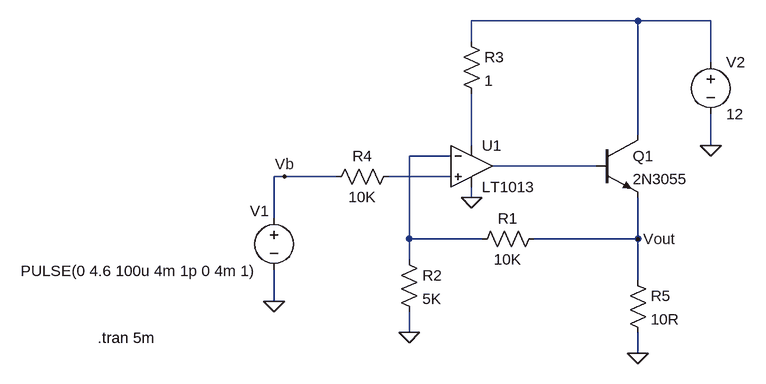
[diagram p0: schematic LM358 Opamp Voltage Source.asc]
LM358 Opamp Voltage Source.asc, the LTspice schematic file:
Version 4
SHEET 1 1400 680
WIRE 816 -128 560 -128
WIRE 928 -128 816 -128
WIRE 560 -96 560 -128
WIRE 928 -64 928 -128
WIRE 816 48 816 -128
WIRE 560 64 560 -16
WIRE 928 64 928 16
WIRE 528 80 464 80
WIRE 752 96 592 96
WIRE 272 112 256 112
WIRE 352 112 272 112
WIRE 528 112 432 112
WIRE 560 144 560 128
WIRE 256 176 256 112
WIRE 464 208 464 80
WIRE 576 208 464 208
WIRE 816 208 816 144
WIRE 816 208 656 208
WIRE 464 240 464 208
WIRE 816 272 816 208
WIRE 256 304 256 256
WIRE 464 352 464 320
WIRE 816 384 816 352
FLAG 256 304 0
FLAG 928 64 0
FLAG 816 384 0
FLAG 464 352 0
FLAG 560 144 0
FLAG 272 112 Vb
FLAG 816 208 Vout
SYMBOL voltage 256 160 R0
WINDOW 0 -37 5 Left 2
WINDOW 3 -390 97 Left 2
WINDOW 123 0 0 Left 2
WINDOW 39 0 0 Left 2
SYMATTR InstName V1
SYMATTR Value PULSE(0 4.6 100u 4m 1p 0 4m 1)
SYMBOL voltage 928 -80 R0
WINDOW 123 0 0 Left 2
WINDOW 39 0 0 Left 2
SYMATTR InstName V2
SYMATTR Value 12
SYMBOL res 672 192 R90
WINDOW 0 0 56 VBottom 2
WINDOW 3 32 56 VTop 2
SYMATTR InstName R1
SYMATTR Value 10K
SYMBOL res 800 256 R0
SYMATTR InstName R5
SYMATTR Value 10R
SYMBOL npn 752 48 R0
SYMATTR InstName Q1
SYMATTR Value 2N3055
SYMBOL Opamps\\LT1013 560 32 R0
SYMATTR InstName U1
SYMBOL res 448 224 R0
SYMATTR InstName R2
SYMATTR Value 5K
SYMBOL res 544 -112 R0
SYMATTR InstName R3
SYMATTR Value 1
SYMBOL res 448 96 R90
WINDOW 0 0 56 VBottom 2
WINDOW 3 32 56 VTop 2
SYMATTR InstName R4
SYMATTR Value 10K
TEXT -16 360 Left 2 !.tran 5m

The netlist it stands for:
* LM358 Opamp Voltage Source.asc
V1 Vb 0 PULSE(0 4.6 100u 4m 1p 0 4m 1)
V2 N001 0 12
R1 Vout N003 10K
R5 Vout 0 10R
Q1 N001 N004 Vout 0 2N3055
XU1 N005 N003 N002 0 N004 LT1013  ; pins In+ In- V+ V- OUT
R2 N003 0 5K
R3 N001 N002 1
R4 N005 Vb 10K
.model NPN NPN
.model PNP PNP
.lib standard.bjt
.tran 5m
.lib LTC.lib
.backanno
.end